# Altium schematic sheet Prox2.SchDoc
size A
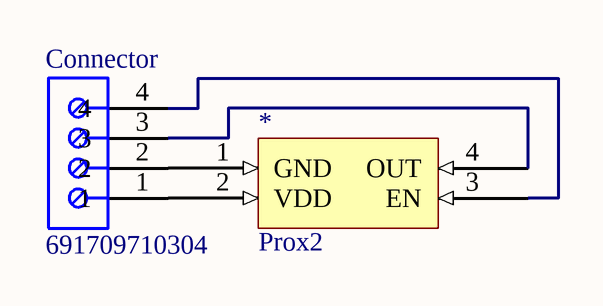
[diagram p0: Prox2.SchDoc]

## Parts
*  Prox2  [PCBComponent_1]
Connector  691709710304  [691709710304]

## Nets
Net*_1: *.1(GND) Connector.2
Net*_2: *.2(VDD) Connector.1
Net*_3: *.3(EN) Connector.4
Net*_4: *.4(OUT) Connector.3

## Library data of the parts
* = Component_1
Connector = CMP-1502-03337-2: NexarPartId: 34171771; Current: 6A; Voltage: 300V; Number of Positions Per Level: 4; Plating: Steel; Wire Gauge (Max): 30AWG; Pitch: 5mm; Connector Type: Screw; Number of Levels: 1; Color: Black; Lead Pitch: 5mm; Mount: Surface Mount; Flammability Rating: UL94 V-0; Termination: Screw; Housing Material: Nylon; Min Operating Temperature: -40°C; REACH SVHC: Unknown; Number of Pins: 4; Contact Plating: Tin; Packaging: Digi-Reel®; Height: 10.2mm; Number of Rows: 1; Number of Positions: 4; Contact Material: Nickel; Current Rating: 6A; Wire Gauge (Min): 30AWG; Voltage Rating: 300V; Length: 20mm; Wire/Cable Gauge: 30AWG; RoHS: Compliant; Number of Contacts: 4; Max Operating Temperature: 130°C